# EAGLE design FT323H.IF (EAGLE 7.4.0)
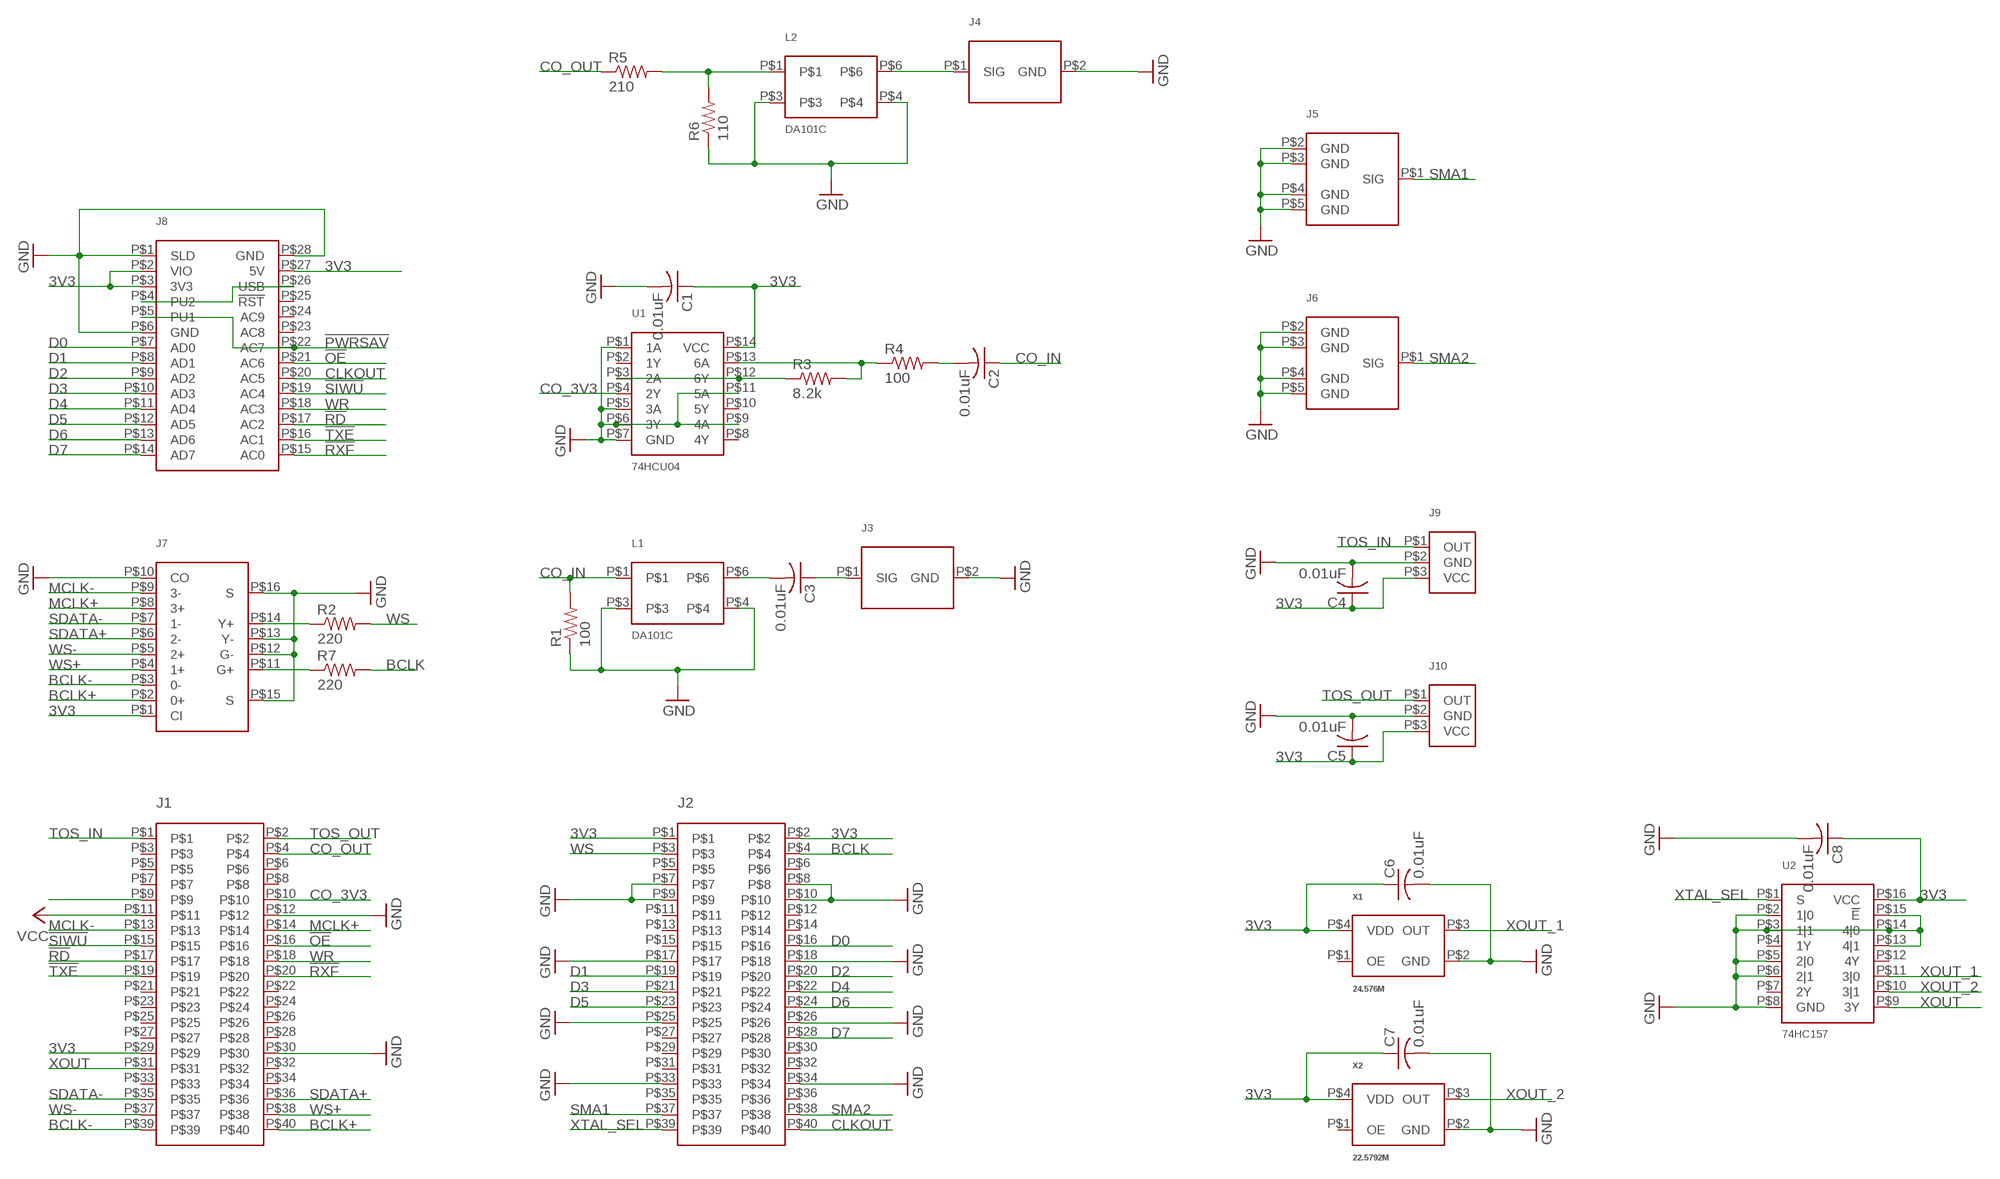
[diagram p0: schematic, sheet 1]

## Parts
C1  0.01uF  C-USC0805  [C0805]
C2  0.01uF  MKS2  [MKS2]
C3  0.01uF  MKS2  [MKS2]
C4  0.01uF  C-USC0805  [C0805]
C5  0.01uF  C-USC0805  [C0805]
C6  0.01uF  C-USC0805  [C0805]
C7  0.01uF  C-USC0805  [C0805]
C8  0.01uF  C-USC0805  [C0805]
J1  JUMPER-2X20  [JUMPER-2X20-2.54MM]
J2  JUMPER-2X20  [JUMPER-2X20-2.54MM]
J3  RCA  [RCA]
J4  RCA  [RCA]
J5  SMA  [SMA]
J6  SMA  [SMA]
J7  HR911130C  [HR911130C]
J8  UM232H  [UM232H]
J9  TORX178A  [TORX178A]
J10  TORX178A  [TORX178A]
L1  DA101C  [DA101C]
L2  DA101C  [DA101C]
R1  100  RES-RJ24  [RJ-24]
R2  220  RES-RJ24  [RJ-24]
R3  8.2k  RES-RJ24  [RJ-24]
R4  100  RES-RJ24  [RJ-24]
R5  210  RES-RJ24  [RJ-24]
R6  110  RES-RJ24  [RJ-24]
R7  220  RES-RJ24  [RJ-24]
U1  74HCU04  [74HCU04D]
U2  74HC157  [74HC157D-SO16]
X1  24.576M  SIT8208  [SIT8208-0507]
X2  22.5792M  SIT8208  [SIT8208-0507]

## Nets
3V3: C1.1 C4.1 C5.1 C6.1 C7.1 C8.1 J1.P$29 J2.P$1 J2.P$2 J7.P$1(CI) J8.P$2(VIO) J8.P$3(3V3) J8.P$27(5V) J9.P$3(VCC) J10.P$3(VCC) U1.P$14(VCC) U2.P$16(VCC) X1.P$4(VDD) X2.P$4(VDD)
!OE: J1.P$16 J8.P$21(AC6)
!PWRSAV: J8.P$5(PU1) J8.P$22(AC7)
!RD: J1.P$17 J8.P$17(AC2)
!RXF: J1.P$20 J8.P$15(AC0)
!SIWU: J1.P$15 J8.P$19(AC4)
!TXE: J1.P$19 J8.P$16(AC1)
BCLK: J2.P$4 R7.P$2
BCLK+: J1.P$40 J7.P$2(0+)
BCLK-: J1.P$39 J7.P$3(0-)
CLKOUT: J2.P$40 J8.P$20(AC5)
CO_3V3: J1.P$10 U1.P$4(2Y)
CO_IN: C2.P$1 L1.P$1 R1.P$2
CO_OUT: J1.P$4 R5.P$1
D0: J2.P$16 J8.P$7(AD0)
D1: J2.P$19 J8.P$8(AD1)
D2: J2.P$20 J8.P$9(AD2)
D3: J2.P$21 J8.P$10(AD3)
D4: J2.P$22 J8.P$11(AD4)
D5: J2.P$23 J8.P$12(AD5)
D6: J2.P$24 J8.P$13(AD6)
D7: J2.P$28 J8.P$14(AD7)
GND: C1.2 C4.2 C5.2 C6.2 C7.2 C8.2 J1.P$12 J1.P$30 J2.P$7 J2.P$8 J2.P$9 J2.P$10 J2.P$17 J2.P$18 J2.P$25 J2.P$26 J2.P$33 J2.P$34 J3.P$2(GND) J4.P$2(GND) J5.P$2(GND) J5.P$3(GND) J5.P$4(GND) J5.P$5(GND) J6.P$2(GND) J6.P$3(GND) J6.P$4(GND) J6.P$5(GND) J7.P$10(CO) J7.P$12(G-) J7.P$13(Y-) J7.P$15(S) J7.P$16(S) J8.P$1(SLD) J8.P$6(GND) J8.P$28(GND) J9.P$2(GND) J10.P$2(GND) L1.P$3 L1.P$4 L2.P$3 L2.P$4 R1.P$1 R6.P$1 U1.P$1(1A) U1.P$5(3A) U1.P$6(3Y) U1.P$7(GND) U1.P$9(4A) U1.P$11(5A) U2.P$2(1|0) U2.P$3(1|1) U2.P$5(2|0) U2.P$6(2|1) U2.P$8(GND) U2.P$13(4|1) U2.P$14(4|0) U2.P$15(!E) X1.P$2(GND) X2.P$2(GND)
MCLK+: J1.P$14 J7.P$8(3+)
MCLK-: J1.P$13 J7.P$9(3-)
N$1: J4.P$1(SIG) L2.P$6
N$2: C3.P$2 L1.P$6
N$3: R3.P$2 R4.P$1 U1.P$13(6A)
N$4: C2.P$2 R4.P$2
N$5: C3.P$1 J3.P$1(SIG)
N$6: R3.P$1 U1.P$3(2A) U1.P$12(6Y)
N$8: J8.P$4(PU2) J8.P$26(USB)
N$9: L2.P$1 R5.P$2 R6.P$2
N$11: J7.P$14(Y+) R2.P$1
N$12: J7.P$11(G+) R7.P$1
N$15: J1.P$9
SDATA+: J1.P$36 J7.P$6(2-)
SDATA-: J1.P$35 J7.P$7(1-)
SMA1: J2.P$37 J5.P$1(SIG)
SMA2: J2.P$38 J6.P$1(SIG)
TOS_IN: J1.P$1 J9.P$1(OUT)
TOS_OUT: J1.P$2 J10.P$1(OUT)
VCC: J1.P$11
WR: J1.P$18 J8.P$18(AC3)
WS: J2.P$3 R2.P$2
WS+: J1.P$38 J7.P$4(1+)
WS-: J1.P$37 J7.P$5(2+)
XOUT: J1.P$31 U2.P$9(3Y)
XOUT_1: U2.P$11(3|0) X1.P$3(OUT)
XOUT_2: U2.P$10(3|1) X2.P$3(OUT)
XTAL_SEL: J2.P$39 U2.P$1(S)
Unconnected: J1.P$3 J1.P$5 J1.P$6 J1.P$7 J1.P$8 J1.P$21 J1.P$22 J1.P$23 J1.P$24 J1.P$25 J1.P$26 J1.P$27 J1.P$28 J1.P$32 J1.P$33 J1.P$34 J2.P$5 J2.P$6 J2.P$11 J2.P$12 J2.P$13 J2.P$14 J2.P$15 J2.P$27 J2.P$29 J2.P$30 J2.P$31 J2.P$32 J2.P$35 J2.P$36 J8.P$23(AC8) J8.P$24(AC9) J8.P$25(!RST) U1.P$2(1Y) U1.P$8(4Y) U1.P$10(5Y) U2.P$4(1Y) U2.P$7(2Y) U2.P$12(4Y) X1.P$1(OE) X2.P$1(OE)

## Library data of the parts
C1 C4-C8 = rcl:C-US: CAPACITOR, American symbol
C2 C3 = rcl:MKS2
J1 J2 = connector:JUMPER-2X20
J3 J4 = connector:RCA
J5 J6 = connector:SMA
J7 = connector:HR911130C
J8 = module:UM232H
J9 J10 = connector:TORX178A
L1 L2 = rcl:DA101C
R1-R7 = rcl:RES-RJ24
U1 = chip:74HCU04
U2 = chip:74HC157
X1 X2 = chip:SIT8208

## Board
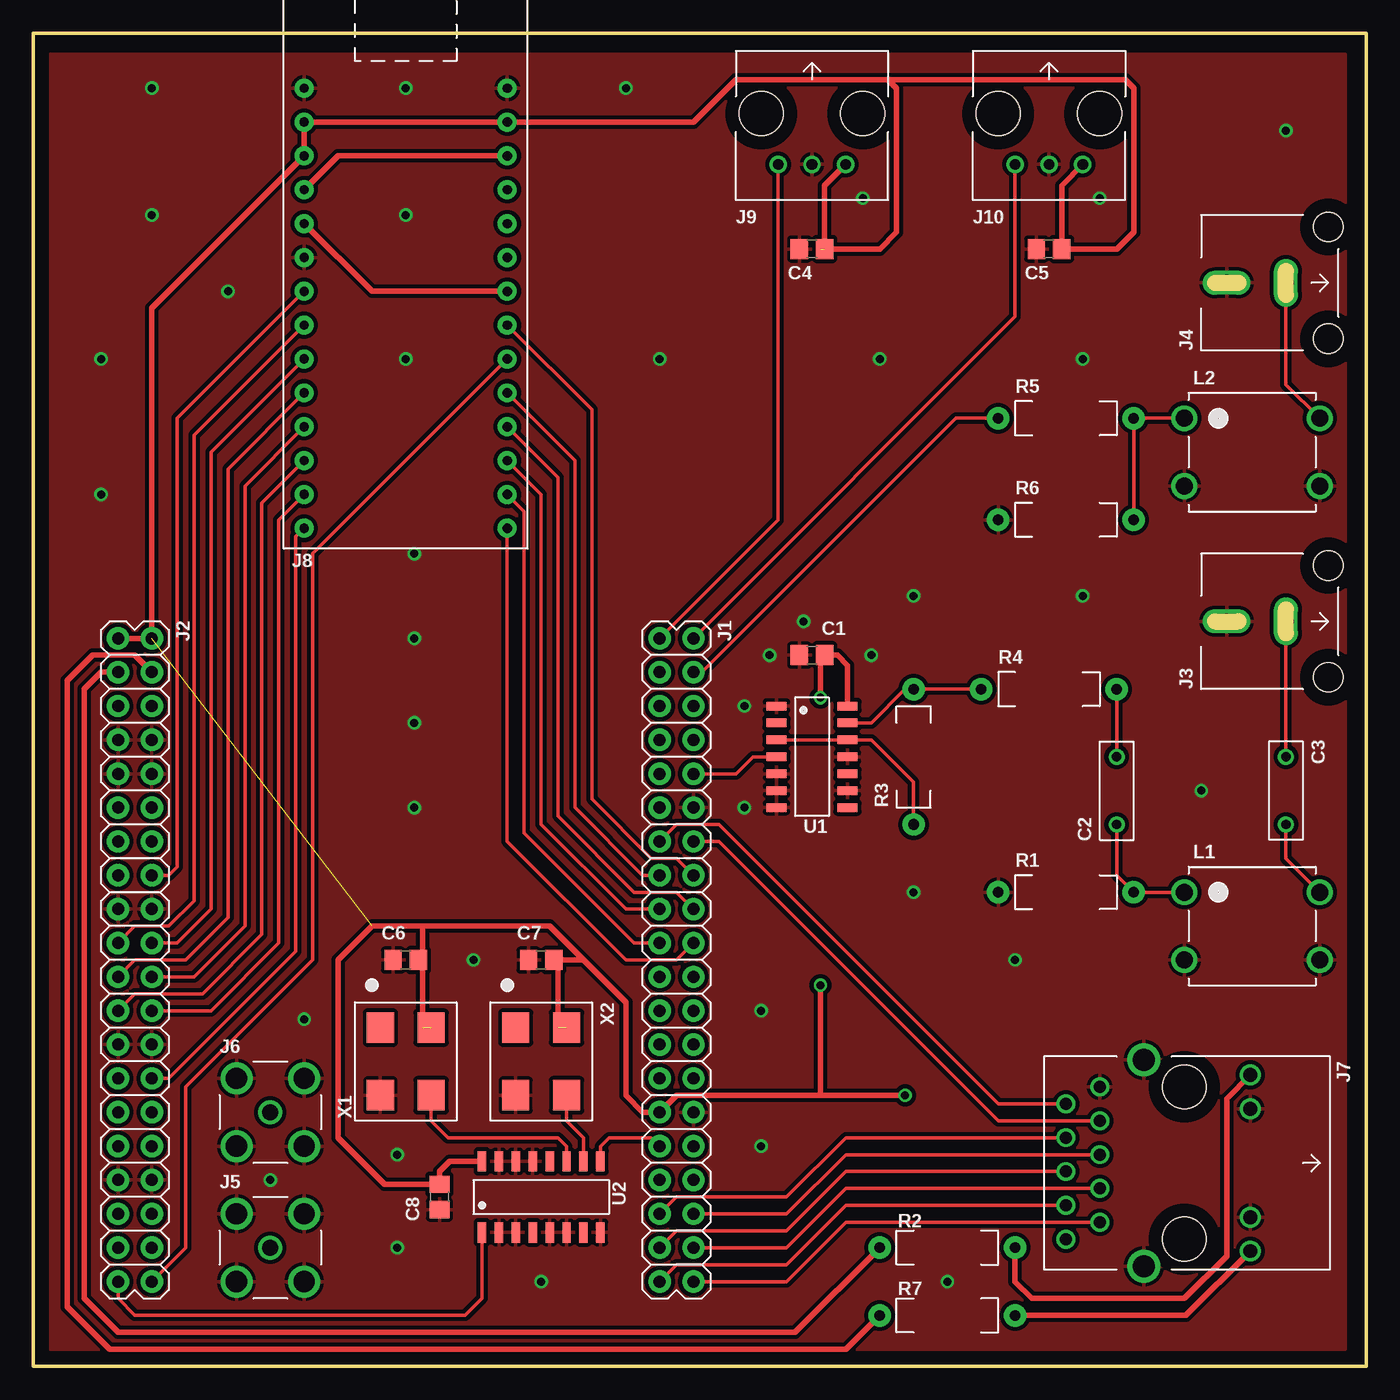
[diagram p1: board, top side]
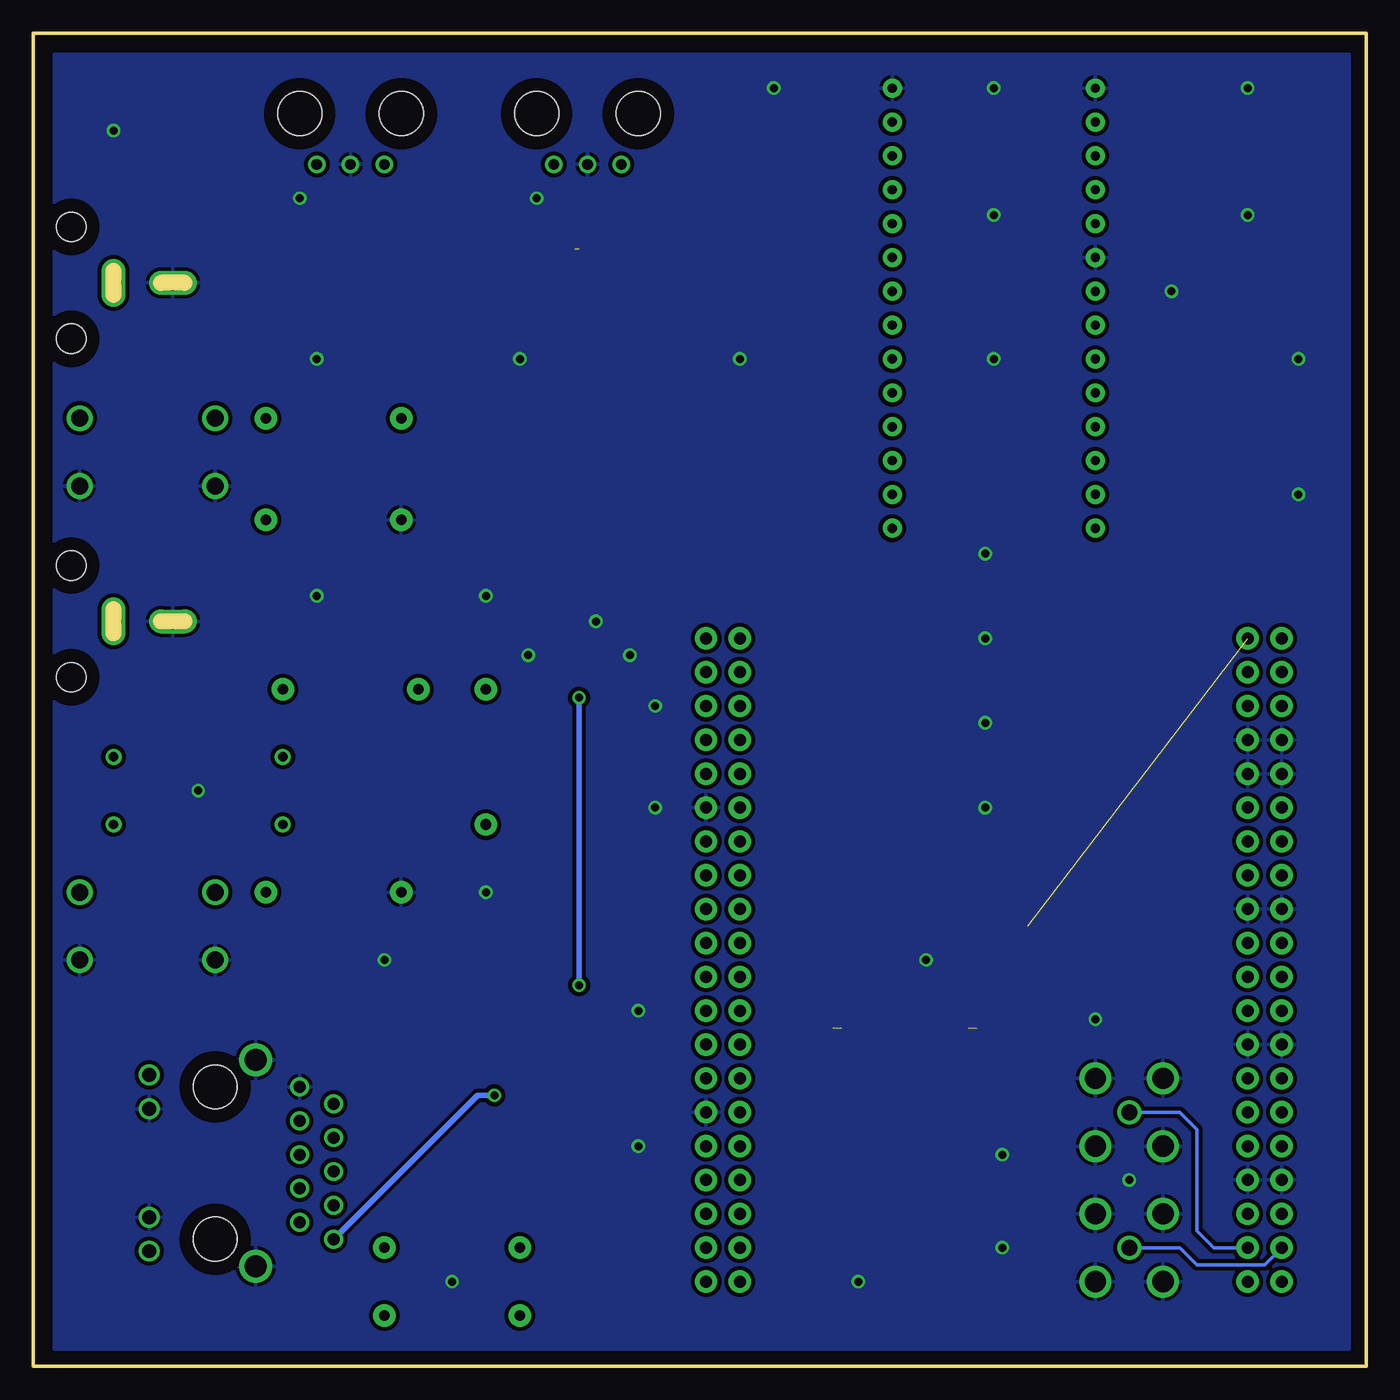
[diagram p2: board, bottom side, seen from below]

Size 100 x 100 mm. Coordinates in mm from the lower left corner, seen from the top.
Outline: 0,0 100,0 100,100 0,100 0,0
Copper layers (1*16): Top 0.035mm / dielectric 1.5mm / Bottom 0.035mm
Design rules "default": minimum track width 10mil, minimum drill 24mil, track to track 8mil, track to pad 8mil, pad to pad 8mil, via to via 8mil, smd to smd 8mil, copper to edge 40mil, drill to drill 8mil, minimum pad ring 10mil, minimum via ring 8mil, stop-mask expansion 4mil, vias tented up to drill 0mil, thermal gap 10mil

### Footprints (pad centres in the part's own frame; a part is rotated, then mirrored left to right if it is on the bottom)
C0805 = smd 1.3 x 1.5: 1 -0.95,0; 2 0.95,0
MKS2 = drill 0.7: P$1 -2.54,0; P$2 2.54,0
JUMPER-2X20-2.54MM = drill 0.9 pad 1.676: P$1 -24.13,-1.27; P$2 -24.13,1.27; P$3 -21.59,-1.27; P$4 -21.59,1.27; P$5 -19.05,-1.27; P$6 -19.05,1.27; P$7 -16.51,-1.27; P$8 -16.51,1.27; P$9 -13.97,-1.27; P$10 -13.97,1.27; P$11 -11.43,-1.27; P$12 -11.43,1.27; P$13 -8.89,-1.27; P$14 -8.89,1.27; P$15 -6.35,-1.27; P$16 -6.35,1.27; P$17 -3.81,-1.27; P$18 -3.81,1.27; P$19 -1.27,-1.27; P$20 -1.27,1.27; P$21 1.27,-1.27; P$22 1.27,1.27; P$23 3.81,-1.27; P$24 3.81,1.27; P$25 6.35,-1.27; P$26 6.35,1.27; P$27 8.89,-1.27; P$28 8.89,1.27; P$29 11.43,-1.27; P$30 11.43,1.27; P$31 13.97,-1.27; P$32 13.97,1.27; P$33 16.51,-1.27; P$34 16.51,1.27; P$35 19.05,-1.27; P$36 19.05,1.27; P$37 21.59,-1.27; P$38 21.59,1.27; P$39 24.13,-1.27; P$40 24.13,1.27
RCA = drill 1.2 long: P$1 0,0; P$2 0,4.445 | hole 2.2: -4.191,-3.175; 4.191,-3.175
SMA = drill 1.2: P$1 0,0 | drill 1.6: P$2 -2.54,-2.54; P$3 2.54,-2.54; P$4 2.54,2.54; P$5 -2.54,2.54
HR911130C = drill 0.9: P$1 5.715,-8.89; P$2 4.445,-6.35; P$3 3.175,-8.89; P$4 1.905,-6.35; P$5 0.635,-8.89; P$6 -0.635,-6.35; P$7 -1.905,-8.89; P$8 -3.175,-6.35; P$9 -4.445,-8.89; P$10 -5.715,-6.35 | drill 1.041: P$11 6.604,4.953; P$12 4.064,4.953; P$13 -4.064,4.953; P$14 -6.604,4.953 | drill 1.651: P$15 7.747,-3.048; P$16 -7.747,-3.048 | hole 3.302: -5.715,0; 5.715,0
UM232H = drill 0.7 pad 1.422: P$1 -16.51,-7.62; P$2 -13.97,-7.62; P$3 -11.43,-7.62; P$4 -8.89,-7.62; P$5 -6.35,-7.62; P$6 -3.81,-7.62; P$7 -1.27,-7.62; P$8 1.27,-7.62; P$9 3.81,-7.62; P$10 6.35,-7.62; P$11 8.89,-7.62; P$12 11.43,-7.62; P$13 13.97,-7.62; P$14 16.51,-7.62; P$15 16.51,7.62; P$16 13.97,7.62; P$17 11.43,7.62; P$18 8.89,7.62; P$19 6.35,7.62; P$20 3.81,7.62; P$21 1.27,7.62; P$22 -1.27,7.62; P$23 -3.81,7.62; P$24 -6.35,7.62; P$25 -8.89,7.62; P$26 -11.43,7.62; P$27 -13.97,7.62; P$28 -16.51,7.62
TORX178A = drill 0.8: P$1 -2.54,-3.81; P$2 0,-3.81; P$3 2.54,-3.81 | hole 3.302: -3.81,0; 3.81,0
DA101C = drill 1.27 pad 1.93: P$1 -5.08,2.54; P$3 -5.08,-2.54; P$4 5.08,-2.54; P$6 5.08,2.54
RJ-24 = drill 0.8 pad 1.676: P$1 -5.08,0; P$2 5.08,0
74HCU04D = smd 0.635 x 1.524: P$1 -3.81,-2.667; P$2 -2.54,-2.667; P$3 -1.27,-2.667; P$4 0,-2.667; P$5 1.27,-2.667; P$6 2.54,-2.667; P$7 3.81,-2.667; P$8 3.81,2.667; P$9 2.54,2.667; P$10 1.27,2.667; P$11 0,2.667; P$12 -1.27,2.667; P$13 -2.54,2.667; P$14 -3.81,2.667
74HC157D-SO16 = smd 0.635 x 1.524: P$1 -4.445,-2.667; P$2 -3.175,-2.667; P$3 -1.905,-2.667; P$4 -0.635,-2.667; P$5 0.635,-2.667; P$6 1.905,-2.667; P$7 3.175,-2.667; P$8 4.445,-2.667; P$9 4.445,2.667; P$10 3.175,2.667; P$11 1.905,2.667; P$12 0.635,2.667; P$13 -0.635,2.667; P$14 -1.905,2.667; P$15 -3.175,2.667; P$16 -4.445,2.667
SIT8208-0507 = smd 2.286 x 2.032: P$1 -2.54,-1.905; P$2 2.54,-1.905; P$3 2.54,1.905; P$4 -2.54,1.905

### Placement (x,y rotation side)
C1  58.42,53.34 180 top
C2  81.28,43.18 90 top
C3  93.98,43.18 270 top
C4  58.42,83.82 180 top
C5  76.2,83.82 180 top
C6  27.94,30.48 180 top
C7  38.1,30.48 180 top
C8  30.48,12.7 270 top
J1  48.26,30.48 270 top
J2  7.62,30.48 270 top
J3  93.98,55.88 90 top
J4  93.98,81.28 90 top
J5  17.78,8.89 0 top
J6  17.78,19.05 0 top
J7  86.36,15.24 270 top
J8  27.94,79.38 270 top
J9  58.42,93.98 0 top
J10  76.2,93.98 0 top
L1  91.44,33.02 0 top
L2  91.44,68.58 0 top
R1  77.47,35.56 0 top
R2  68.58,8.89 180 top
R3  66.04,45.72 90 top
R4  76.2,50.8 0 top
R5  77.47,71.12 0 top
R6  77.47,63.5 0 top
R7  68.58,3.81 180 top
U1  58.42,45.72 270 top
U2  38.1,12.7 0 top
X1  27.94,22.86 270 top
X2  38.1,22.86 270 top

### Tracks (layer width: path | path; a pad name or v marks a point on that pad's centre or on a via)
3V3  (via drill 0.6)  (4 unrouted)
  Top 0.406: U1.P$14 61.09,52.58 60.33,53.34 C1.1 59.05,53.02 v59.05,50.16 | U2.P$16 31.24,15.37 30.48,14.61 C8.1 26.36,13.65 22.86,17.14 22.86,30.48 25.4,33.02 29.21,33.02 | 41.27,30.48 44.45,27.3 44.45,20.32 45.72,19.05 J1.P$29 48.26,20.32 59.05,20.32 | 41.27,30.48 38.73,33.02 29.21,33.02 | 29.21,25.4 29.21,30.16 C6.1 29.21,30.8 29.21,33.02 | C7.1 39.37,30.8 | 39.37,30.8 39.37,25.4 | 39.37,30.8 39.69,30.48 41.27,30.48 | J2.P$1 J2.P$2 8.89,79.38 J8.P$3 J8.P$2 J8.P$27 49.53,93.34 52.7,96.52 64.14,96.52 | C4.1 59.37,88.58 J9.P$3 | J10.P$3 77.15,88.58 C5.1 81.28,83.82 82.55,85.09 82.55,95.89 81.92,96.52 64.14,96.52 | 59.05,83.82 63.5,83.82 64.77,85.09 64.77,95.89 64.14,96.52 | 59.05,20.32 v65.41,20.32 | v59.05,28.57 59.05,20.32
  Bottom 0.406: v65.41,20.32 66.67,20.32 J7.P$1 | v59.05,28.57 v59.05,50.16
!OE
  Top 0.254: J1.P$16 48.26,38.1 46.35,38.1 41.91,42.55 41.91,71.75 J8.P$21
!PWRSAV
  Top 0.406: J8.P$5 25.4,80.64 J8.P$22
!RD
  Top 0.254: J8.P$17 38.1,65.41 38.1,40.64 44.45,34.29 J1.P$17
!RXF
  Top 0.254: J8.P$15 35.56,39.37 44.45,30.48 48.26,30.48 J1.P$20
!SIWU
  Top 0.254: J8.P$19 40.64,67.94 40.64,41.91 45.72,36.83 J1.P$15
!TXE
  Top 0.254: J1.P$19 45.09,31.75 36.83,40.01 36.83,64.14 J8.P$16
BCLK
  Top 0.406: J2.P$4 7.62,53.34 4.45,53.34 2.54,51.44 2.54,4.45 5.71,1.27 60.96,1.27 R7.P$2
BCLK+
  Top 0.254: J1.P$40 56.52,6.35 60.96,10.79 J7.P$2
BCLK-
  Top 0.254: J1.P$39 48.26,7.62 56.52,7.62 60.96,12.06 J7.P$3
CLKOUT
  Top 0.254: J2.P$40 11.43,8.89 11.43,20.95 20.95,30.48 20.95,60.96 J8.P$20
CO_3V3
  Top 0.254: J1.P$10 52.7,44.45 53.98,45.72 U1.P$4
CO_IN
  Top 0.254: L1.P$1 R1.P$2 81.28,36.83 C2.P$1
CO_OUT
  Top 0.254: R5.P$1 69.22,71.12 50.16,52.07 J1.P$4
D0
  Top 0.254: J8.P$7 10.79,71.12 10.79,37.47 10.16,36.83 J2.P$16
D1
  Top 0.254: J2.P$19 7.62,33.02 10.16,33.02 12.06,34.92 12.06,69.85 J8.P$8
D2
  Top 0.254: J8.P$9 13.34,68.58 13.34,34.29 10.79,31.75 J2.P$20
D3
  Top 0.254: J2.P$21 7.62,30.48 11.43,30.48 14.61,33.66 14.61,67.31 J8.P$10
D4
  Top 0.254: J8.P$11 15.88,66.04 15.88,33.02 12.06,29.21 J2.P$22
D5
  Top 0.254: J2.P$23 7.62,27.94 12.7,27.94 17.14,32.38 17.14,64.77 J8.P$12
D6
  Top 0.254: J8.P$13 18.41,63.5 18.41,31.75 13.34,26.67 J2.P$24
D7
  Top 0.254: J2.P$28 10.16,21.59 19.68,31.11 19.68,62.23 J8.P$14
GND  (via drill 0.6)
  other vias: 8.89,95.89 8.89,86.36 5.08,75.56 5.08,65.41 14.61,80.64 27.94,95.89 27.94,86.36 27.94,75.56 28.57,60.96 28.57,54.61 28.57,48.26 28.57,41.91 20.32,26.04 17.78,13.97 27.3,15.88 27.3,8.89 38.1,6.35 33.02,30.48 54.61,16.51 68.58,6.35 54.61,26.67 73.66,30.48 87.63,43.18 78.74,57.78 78.74,75.56 63.5,75.56 46.99,75.56 93.98,92.71 44.45,95.89 62.23,87.63 80.01,87.63 66.04,57.78 62.87,53.34 57.78,55.88 55.24,53.34 53.34,49.53 53.34,41.91 66.04,35.56
  pour Top (isolate 0.305): 1.27,1.27 98.42,1.27 98.42,98.42 1.27,98.42
  pour Bottom (isolate 0.305): 1.27,1.27 98.42,1.27 98.42,98.42 1.27,98.42
MCLK+
  Top 0.254: J1.P$14 51.44,39.37 72.39,18.41 J7.P$8
MCLK-
  Top 0.254: J1.P$13 48.26,40.64 51.44,40.64 72.39,19.68 J7.P$9
N$1
  Top 0.254: J4.P$1 93.98,73.66 L2.P$6
N$2
  Top 0.254: C3.P$2 93.98,38.1 L1.P$6
N$3
  Top 0.254: R4.P$1 R3.P$2 65.41,50.8 62.87,48.26 U1.P$13
N$4
  Top 0.254: C2.P$2 R4.P$2
N$5
  Top 0.254: J3.P$1 C3.P$1
N$6
  Top 0.254: U1.P$3 U1.P$12 62.87,46.99 66.04,43.81 R3.P$1
N$8
  Top 0.406: J8.P$4 22.86,90.81 J8.P$26
N$9
  Top 0.254: L2.P$1 R5.P$2 R6.P$2
N$11
  Top 0.406: R2.P$1 73.66,6.35 74.93,5.08 86.36,5.08 89.53,8.26 89.53,20.07 J7.P$14
N$12
  Top 0.406: R7.P$1 86.49,3.81 J7.P$11
SDATA+
  Top 0.254: J1.P$36 56.52,11.43 60.96,15.88 J7.P$6
SDATA-
  Top 0.254: J1.P$35 48.26,12.7 56.52,12.7 60.96,17.14 J7.P$7
SMA1
  Bottom 0.254: J2.P$37 7.62,7.62 12.7,7.62 13.97,8.89 J5.P$1
SMA2
  Bottom 0.254: J6.P$1 13.97,19.05 12.7,17.78 12.7,10.16 11.43,8.89 J2.P$38
TOS_IN
  Top 0.254: J9.P$1 55.88,63.5 J1.P$1
TOS_OUT
  Top 0.254: J10.P$1 73.66,78.74 J1.P$2
WR
  Top 0.254: J1.P$18 48.26,35.56 45.09,35.56 39.37,41.27 39.37,66.67 J8.P$18
WS
  Top 0.406: J2.P$3 5.08,52.07 3.81,50.8 3.81,5.08 6.35,2.54 57.15,2.54 R2.P$2
WS+
  Top 0.254: J1.P$38 56.52,8.89 60.96,13.34 J7.P$4
WS-
  Top 0.254: J1.P$37 48.26,10.16 56.52,10.16 60.96,14.61 J7.P$5
XOUT
  Top 0.254: U2.P$9 42.55,16.51 43.18,17.14 46.35,17.14 J1.P$31
XOUT_1
  Top 0.254: X1.P$3 29.84,18.41 31.11,17.14 39.37,17.14 40.01,16.51 U2.P$11
XOUT_2
  Top 0.254: X2.P$3 40.01,18.41 41.27,17.14 U2.P$10
XTAL_SEL
  Top 0.254: J2.P$39 6.35,5.08 7.62,3.81 32.38,3.81 33.66,5.08 U2.P$1